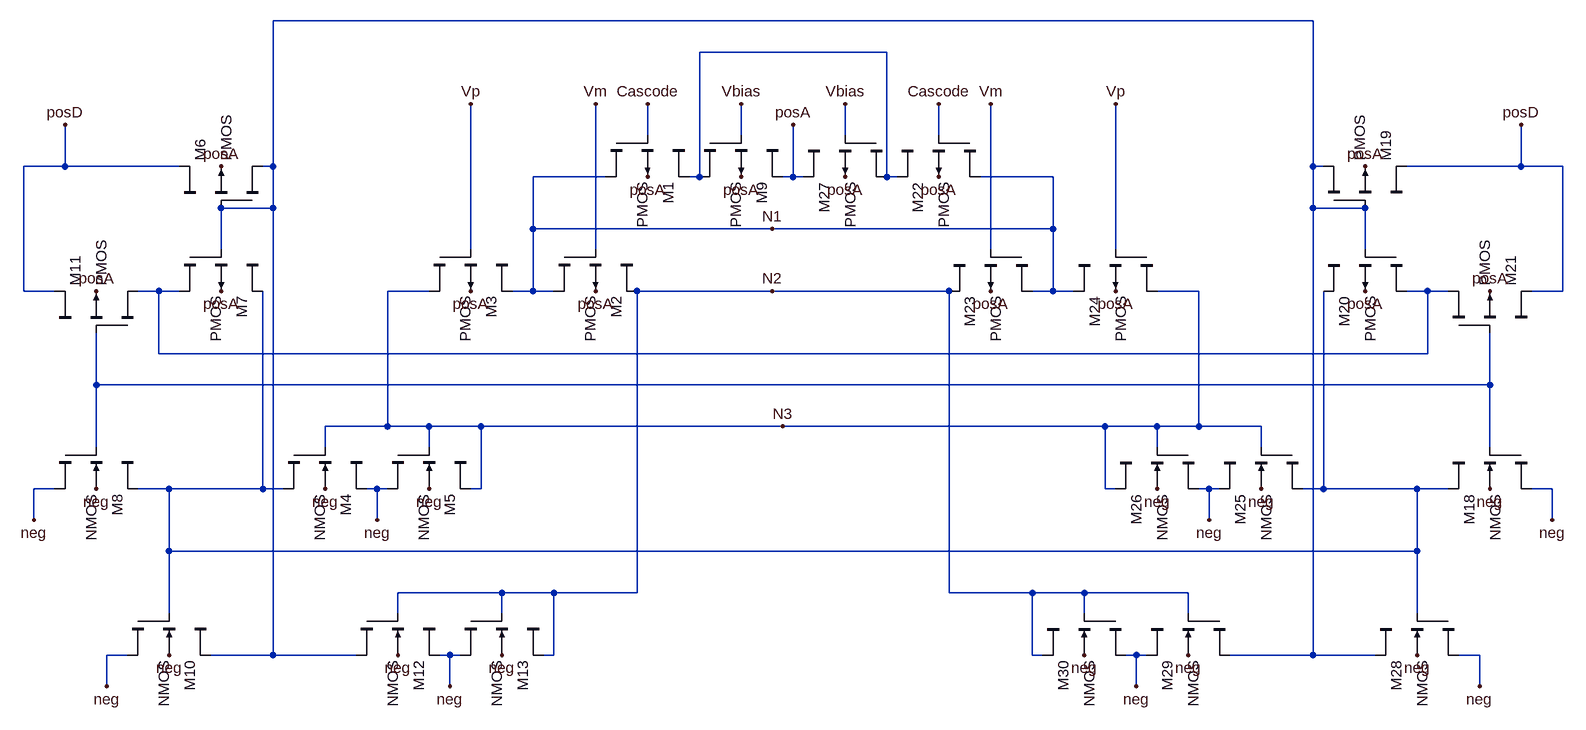
[diagram p0: schematic comparator_gainlatch_LDS.asc]
comparator_gainlatch_LDS.asc, the LTspice schematic file:
Version 4
SHEET 1 2168 1948
WIRE 1536 80 -64 80
WIRE 880 128 592 128
WIRE 512 256 512 208
WIRE 656 256 656 208
WIRE 816 256 816 208
WIRE 960 256 960 208
WIRE -384 304 -384 240
WIRE -384 304 -448 304
WIRE -208 304 -384 304
WIRE -64 304 -64 80
WIRE -64 304 -80 304
WIRE 1536 304 1536 80
WIRE 1552 304 1536 304
WIRE 1856 304 1856 240
WIRE 1856 304 1680 304
WIRE 1920 304 1856 304
WIRE 448 320 336 320
WIRE 592 320 592 128
WIRE 592 320 576 320
WIRE 736 320 736 240
WIRE 736 320 720 320
WIRE 752 320 736 320
WIRE 880 320 880 128
WIRE 896 320 880 320
WIRE 1136 320 1024 320
WIRE -64 368 -64 304
WIRE -64 368 -144 368
WIRE 1536 368 1536 304
WIRE 1616 368 1536 368
WIRE 336 400 336 320
WIRE 704 400 336 400
WIRE 1136 400 1136 320
WIRE 1136 400 704 400
WIRE -144 432 -144 368
WIRE 240 432 240 208
WIRE 432 432 432 208
WIRE 1040 432 1040 208
WIRE 1232 432 1232 208
WIRE 1616 432 1616 368
WIRE -448 496 -448 304
WIRE -400 496 -448 496
WIRE -240 496 -272 496
WIRE -208 496 -240 496
WIRE 176 496 112 496
WIRE 336 496 336 400
WIRE 336 496 304 496
WIRE 368 496 336 496
WIRE 704 496 496 496
WIRE 976 496 704 496
WIRE 1136 496 1136 400
WIRE 1136 496 1104 496
WIRE 1168 496 1136 496
WIRE 1360 496 1296 496
WIRE 1712 496 1680 496
WIRE 1744 496 1712 496
WIRE 1920 496 1920 304
WIRE 1920 496 1872 496
WIRE -240 592 -240 496
WIRE 1712 592 1712 496
WIRE 1712 592 -240 592
WIRE -336 640 -336 560
WIRE 1808 640 1808 560
WIRE 1808 640 -336 640
WIRE 112 704 112 496
WIRE 112 704 16 704
WIRE 176 704 112 704
WIRE 256 704 176 704
WIRE 720 704 256 704
WIRE 1216 704 720 704
WIRE 1296 704 1216 704
WIRE 1360 704 1360 496
WIRE 1360 704 1296 704
WIRE 1456 704 1360 704
WIRE -336 736 -336 640
WIRE 16 736 16 704
WIRE 176 736 176 704
WIRE 1296 736 1296 704
WIRE 1456 736 1456 704
WIRE 1808 736 1808 640
WIRE -400 800 -432 800
WIRE -224 800 -272 800
WIRE -80 800 -80 496
WIRE -80 800 -224 800
WIRE -48 800 -80 800
WIRE 96 800 80 800
WIRE 112 800 96 800
WIRE 256 800 256 704
WIRE 256 800 240 800
WIRE 1216 800 1216 704
WIRE 1232 800 1216 800
WIRE 1376 800 1360 800
WIRE 1392 800 1376 800
WIRE 1552 800 1552 496
WIRE 1552 800 1520 800
WIRE 1696 800 1552 800
WIRE 1744 800 1696 800
WIRE 1904 800 1872 800
WIRE -432 848 -432 800
WIRE 96 848 96 800
WIRE 1376 848 1376 800
WIRE 1904 848 1904 800
WIRE -224 896 -224 800
WIRE 1696 896 1696 800
WIRE 1696 896 -224 896
WIRE 288 960 128 960
WIRE 368 960 288 960
WIRE 496 960 496 496
WIRE 496 960 368 960
WIRE 976 960 976 496
WIRE 1104 960 976 960
WIRE 1184 960 1104 960
WIRE 1344 960 1184 960
WIRE -224 992 -224 896
WIRE 128 992 128 960
WIRE 288 992 288 960
WIRE 1184 992 1184 960
WIRE 1344 992 1344 960
WIRE 1696 992 1696 896
WIRE -288 1056 -320 1056
WIRE -64 1056 -64 368
WIRE -64 1056 -160 1056
WIRE 64 1056 -64 1056
WIRE 208 1056 192 1056
WIRE 224 1056 208 1056
WIRE 368 1056 368 960
WIRE 368 1056 352 1056
WIRE 1104 1056 1104 960
WIRE 1120 1056 1104 1056
WIRE 1264 1056 1248 1056
WIRE 1280 1056 1264 1056
WIRE 1536 1056 1536 368
WIRE 1536 1056 1408 1056
WIRE 1632 1056 1536 1056
WIRE 1792 1056 1760 1056
WIRE -320 1104 -320 1056
WIRE 208 1104 208 1056
WIRE 1264 1104 1264 1056
WIRE 1792 1104 1792 1056
FLAG -336 800 neg
FLAG -144 304 posA
FLAG -384 240 posD
FLAG 512 320 posA
FLAG -336 496 posA
FLAG -144 496 posA
FLAG 16 800 neg
FLAG 176 800 neg
FLAG 240 496 posA
FLAG 432 496 posA
FLAG 656 320 posA
FLAG 512 208 Cascode
FLAG 656 208 Vbias
FLAG 240 208 Vp
FLAG 432 208 Vm
FLAG -224 1056 neg
FLAG 128 1056 neg
FLAG 288 1056 neg
FLAG -320 1104 neg
FLAG 208 1104 neg
FLAG 96 848 neg
FLAG -432 848 neg
FLAG 1808 800 neg
FLAG 1616 304 posA
FLAG 1856 240 posD
FLAG 960 320 posA
FLAG 1808 496 posA
FLAG 1616 496 posA
FLAG 1456 800 neg
FLAG 1296 800 neg
FLAG 1232 496 posA
FLAG 1040 496 posA
FLAG 816 320 posA
FLAG 736 240 posA
FLAG 960 208 Cascode
FLAG 816 208 Vbias
FLAG 1232 208 Vp
FLAG 1040 208 Vm
FLAG 1696 1056 neg
FLAG 1344 1056 neg
FLAG 1184 1056 neg
FLAG 1792 1104 neg
FLAG 1264 1104 neg
FLAG 1376 848 neg
FLAG 1904 848 neg
FLAG 704 400 N1
FLAG 704 496 N2
FLAG 720 704 N3
SYMBOL cktsym\\nmos4 -336 800 R90
SYMATTR InstName M8
SYMATTR Value2 l=1.8u w=3.6u
SYMBOL cktsym\\pmos4 -144 304 R270
SYMATTR InstName M6
SYMATTR Value2 l=2.7u w=4.5u
SYMBOL cktsym\\pmos4 -144 496 R90
SYMATTR InstName M7
SYMATTR Value2 l=0.6u w=0.9u
SYMBOL cktsym\\pmos4 -336 496 R270
SYMATTR InstName M11
SYMATTR Value2 l=2.7u w=4.5u
SYMBOL cktsym\\pmos4 512 320 R90
SYMATTR InstName M1
SYMATTR Value2 l=2.4u w=4.8u
SYMBOL cktsym\\pmos4 432 496 R90
SYMATTR InstName M2
SYMATTR Value2 l=3.6u w=3.6u
SYMBOL cktsym\\pmos4 240 496 R90
SYMATTR InstName M3
SYMATTR Value2 l=3.6u w=3.6u
SYMBOL cktsym\\nmos4 16 800 R90
SYMATTR InstName M4
SYMATTR Value2 l=2.7u w=2.4u
SYMBOL cktsym\\nmos4 176 800 R90
SYMATTR InstName M5
SYMATTR Value2 l=2.7u w=2.4u
SYMBOL cktsym\\pmos4 656 320 R90
SYMATTR InstName M9
SYMATTR Value2 l=18u w=9u
SYMBOL cktsym\\nmos4 -224 1056 R90
SYMATTR InstName M10
SYMATTR Value2 l=1.8u w=3.6u
SYMBOL cktsym\\nmos4 128 1056 R90
SYMATTR InstName M12
SYMATTR Value2 l=2.7u w=2.4u
SYMBOL cktsym\\nmos4 288 1056 R90
SYMATTR InstName M13
SYMATTR Value2 l=2.7u w=2.4u
SYMBOL cktsym\\nmos4 1808 800 M90
SYMATTR InstName M18
SYMATTR Value2 l=1.8u w=3.6u
SYMBOL cktsym\\pmos4 1616 304 M270
SYMATTR InstName M19
SYMATTR Value2 l=2.7u w=4.5u
SYMBOL cktsym\\pmos4 1616 496 M90
SYMATTR InstName M20
SYMATTR Value2 l=0.6u w=0.9u
SYMBOL cktsym\\pmos4 1808 496 M270
SYMATTR InstName M21
SYMATTR Value2 l=2.7u w=4.5u
SYMBOL cktsym\\pmos4 960 320 M90
SYMATTR InstName M22
SYMATTR Value2 l=2.4u w=4.8u
SYMBOL cktsym\\pmos4 1040 496 M90
SYMATTR InstName M23
SYMATTR Value2 l=3.6u w=3.6u
SYMBOL cktsym\\pmos4 1232 496 M90
SYMATTR InstName M24
SYMATTR Value2 l=3.6u w=3.6u
SYMBOL cktsym\\nmos4 1456 800 M90
SYMATTR InstName M25
SYMATTR Value2 l=2.7u w=2.4u
SYMBOL cktsym\\nmos4 1296 800 M90
SYMATTR InstName M26
SYMATTR Value2 l=2.7u w=2.4u
SYMBOL cktsym\\pmos4 816 320 M90
SYMATTR InstName M27
SYMATTR Value2 l=18u w=9u
SYMBOL cktsym\\nmos4 1696 1056 M90
SYMATTR InstName M28
SYMATTR Value2 l=1.8u w=3.6u
SYMBOL cktsym\\nmos4 1344 1056 M90
SYMATTR InstName M29
SYMATTR Value2 l=2.7u w=2.4u
SYMBOL cktsym\\nmos4 1184 1056 M90
SYMATTR InstName M30
SYMATTR Value2 l=2.7u w=2.4u

The netlist it stands for:
* comparator_gainlatch_LDS.asc
M8 N005 N004 neg neg NMOS l=1.8u w=3.6u
M6 N001 N001 posD posA PMOS l=2.7u w=4.5u
M7 N003 N001 N005 posA PMOS l=0.6u w=0.9u
M11 N003 N004 posD posA PMOS l=2.7u w=4.5u
M1 N1 Cascode N002 posA PMOS l=2.4u w=4.8u
M2 N1 Vm N2 posA PMOS l=3.6u w=3.6u
M3 N3 Vp N1 posA PMOS l=3.6u w=3.6u
M4 neg N3 N005 neg NMOS l=2.7u w=2.4u
M5 N3 N3 neg neg NMOS l=2.7u w=2.4u
M9 N002 Vbias posA posA PMOS l=18u w=9u
M10 N001 N005 neg neg NMOS l=1.8u w=3.6u
M12 neg N2 N001 neg NMOS l=2.7u w=2.4u
M13 N2 N2 neg neg NMOS l=2.7u w=2.4u
M18 N005 N004 neg neg NMOS l=1.8u w=3.6u
M19 N001 N001 posD posA PMOS l=2.7u w=4.5u
M20 N003 N001 N005 posA PMOS l=0.6u w=0.9u
M21 N003 N004 posD posA PMOS l=2.7u w=4.5u
M22 N1 Cascode N002 posA PMOS l=2.4u w=4.8u
M23 N1 Vm N2 posA PMOS l=3.6u w=3.6u
M24 N3 Vp N1 posA PMOS l=3.6u w=3.6u
M25 neg N3 N005 neg NMOS l=2.7u w=2.4u
M26 N3 N3 neg neg NMOS l=2.7u w=2.4u
M27 N002 Vbias posA posA PMOS l=18u w=9u
M28 N001 N005 neg neg NMOS l=1.8u w=3.6u
M29 neg N2 N001 neg NMOS l=2.7u w=2.4u
M30 N2 N2 neg neg NMOS l=2.7u w=2.4u
.model NMOS NMOS
.model PMOS PMOS
.lib standard.mos
.backanno
.end